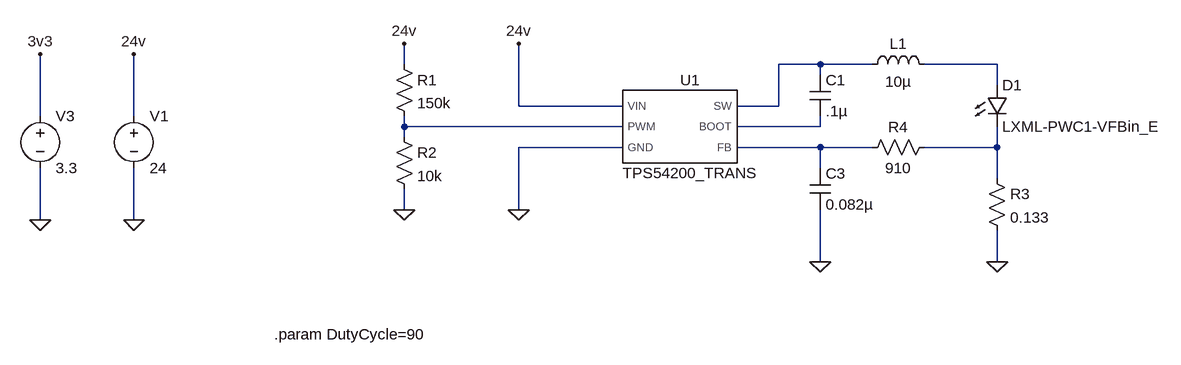
[diagram p0: schematic TPS54200_Test1.asc]
TPS54200_Test1.asc, the LTspice schematic file:
Version 4
SHEET 1 880 680
WIRE -1328 -48 -1328 -80
WIRE -688 -48 -752 -48
WIRE -608 -48 -688 -48
WIRE -416 -48 -528 -48
WIRE -688 -32 -688 -48
WIRE -416 -16 -416 -48
WIRE -1152 16 -1152 -80
WIRE -992 16 -1152 16
WIRE -752 16 -752 -48
WIRE -752 16 -816 16
WIRE -1888 32 -1888 -64
WIRE -1744 32 -1744 -64
WIRE -1328 48 -1328 32
WIRE -992 48 -1328 48
WIRE -688 48 -688 32
WIRE -688 48 -816 48
WIRE -1328 64 -1328 48
WIRE -992 80 -1152 80
WIRE -688 80 -816 80
WIRE -608 80 -688 80
WIRE -416 80 -416 48
WIRE -416 80 -528 80
WIRE -688 112 -688 80
WIRE -416 128 -416 80
WIRE -1328 176 -1328 144
WIRE -1152 176 -1152 80
WIRE -1888 192 -1888 112
WIRE -1744 192 -1744 112
WIRE -688 256 -688 176
WIRE -416 256 -416 208
FLAG -1888 192 0
FLAG -1888 -64 3v3
FLAG -1152 176 0
FLAG -1744 192 0
FLAG -1744 -64 24v
FLAG -1152 -80 24v
FLAG -1328 176 0
FLAG -1328 -80 24v
FLAG -416 256 0
FLAG -688 256 0
SYMBOL voltage -1888 16 R0
SYMATTR InstName V3
SYMATTR Value 3.3
SYMBOL TPS54200_TRANS -928 48 R0
SYMATTR InstName U1
SYMBOL voltage -1744 16 R0
SYMATTR InstName V1
SYMATTR Value 24
SYMBOL res -1344 -64 R0
SYMATTR InstName R1
SYMATTR Value 150k
SYMBOL res -1344 48 R0
SYMATTR InstName R2
SYMATTR Value 10k
SYMBOL ind -624 -32 R270
WINDOW 0 32 56 VTop 2
WINDOW 3 5 56 VBottom 2
SYMATTR InstName L1
SYMATTR Value 10µ
SYMBOL LED -432 -16 R0
SYMATTR InstName D1
SYMATTR Value LXML-PWC1-VFBin_E
SYMATTR Description Diode
SYMATTR Type diode
SYMBOL res -432 112 R0
SYMATTR InstName R3
SYMATTR Value 0.133
SYMBOL res -512 64 R90
WINDOW 0 0 56 VBottom 2
WINDOW 3 32 56 VTop 2
SYMATTR InstName R4
SYMATTR Value 910
SYMBOL cap -704 -32 R0
SYMATTR InstName C1
SYMATTR Value .1µ
SYMBOL cap -704 112 R0
SYMATTR InstName C3
SYMATTR Value 0.082µ
TEXT -1528 368 Left 2 !.param DutyCycle=90

The netlist it stands for:
* TPS54200_Test1.asc
V3 3v3 0 3.3
XU1 N004 N005 0 N003 N001 24v TPS54200_TRANS  ; pins BOOT FB GND PWM SW VIN
V1 24v 0 24
R1 24v N003 150k
R2 N003 0 10k
L1 N001 N002 10µ
D1 N002 N006 LXML-PWC1-VFBin_E
R3 N006 0 0.133
R4 N006 N005 910
C1 N001 N004 .1µ
C3 N005 0 0.082µ
.model D D
.lib standard.dio
.param DutyCycle=90
.lib C:\Users\ukjkin\Documents\GitHub\Outdoor_Lamp_LED_Driver\Simulations\TPS54200_PSPICE_TRANS\TPS54200_TRANS.lib
.backanno
.end